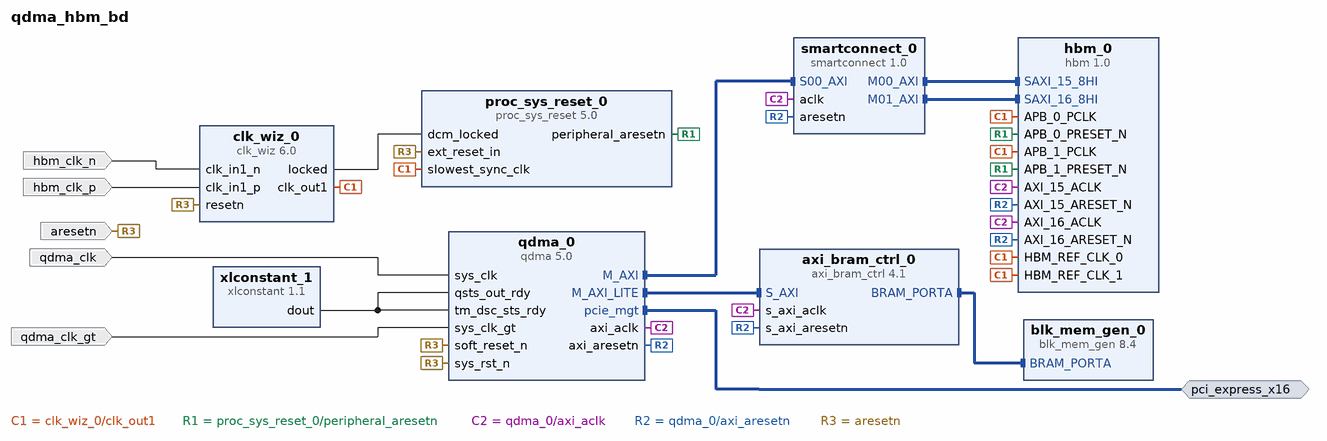
[diagram p0: block diagram of the top level]
# Vivado block design qdma_hbm_bd, xcu55c-fsvh2892-2L-e, Vivado 2024.2
create_bd_design qdma_hbm_bd

create_bd_intf_port -mode Master -vlnv xilinx.com:interface:pcie_7x_mgt_rtl:1.0 pci_express_x16
create_bd_port -dir I -type clk hbm_clk_n
set_property -dict {CONFIG.FREQ_HZ 100000000} [get_bd_ports hbm_clk_n]
create_bd_port -dir I -type clk hbm_clk_p
set_property -dict {CONFIG.FREQ_HZ 100000000} [get_bd_ports hbm_clk_p]
create_bd_port -dir I -type rst aresetn
create_bd_port -dir I -type clk qdma_clk
create_bd_port -dir I -type clk qdma_clk_gt

create_bd_cell -type ip -vlnv xilinx.com:ip:hbm:1.0 hbm_0
set_property -dict [list \
  CONFIG.USER_APB_EN false \
  CONFIG.USER_AXI_INPUT_CLK1_FREQ 250 \
  CONFIG.USER_AXI_INPUT_CLK_FREQ 250 \
  CONFIG.USER_HBM_DENSITY 16GB \
  CONFIG.USER_MC0_USER_PARITY_EN false \
  CONFIG.USER_SAXI_00 false \
  CONFIG.USER_SAXI_01 false \
  CONFIG.USER_SAXI_02 false \
  CONFIG.USER_SAXI_03 false \
  CONFIG.USER_SAXI_04 false \
  CONFIG.USER_SAXI_05 false \
  CONFIG.USER_SAXI_06 false \
  CONFIG.USER_SAXI_07 false \
  CONFIG.USER_SAXI_08 false \
  CONFIG.USER_SAXI_09 false \
  CONFIG.USER_SAXI_10 false \
  CONFIG.USER_SAXI_11 false \
  CONFIG.USER_SAXI_12 false \
  CONFIG.USER_SAXI_13 false \
  CONFIG.USER_SAXI_14 false \
  CONFIG.USER_SAXI_17 false \
  CONFIG.USER_SAXI_18 false \
  CONFIG.USER_SAXI_19 false \
  CONFIG.USER_SAXI_20 false \
  CONFIG.USER_SAXI_21 false \
  CONFIG.USER_SAXI_22 false \
  CONFIG.USER_SAXI_23 false \
  CONFIG.USER_SAXI_24 false \
  CONFIG.USER_SAXI_25 false \
  CONFIG.USER_SAXI_26 false \
  CONFIG.USER_SAXI_27 false \
  CONFIG.USER_SAXI_28 false \
  CONFIG.USER_SAXI_29 false \
  CONFIG.USER_SAXI_30 false \
  CONFIG.USER_SAXI_31 false \
] [get_bd_cells hbm_0]
create_bd_cell -type ip -vlnv xilinx.com:ip:smartconnect:1.0 smartconnect_0
set_property -dict {CONFIG.NUM_MI 2 CONFIG.NUM_SI 1} [get_bd_cells smartconnect_0]
create_bd_cell -type ip -vlnv xilinx.com:ip:clk_wiz:6.0 clk_wiz_0
set_property -dict [list \
  CONFIG.PRIM_SOURCE Differential_clock_capable_pin \
  CONFIG.RESET_PORT resetn \
  CONFIG.RESET_TYPE ACTIVE_LOW \
] [get_bd_cells clk_wiz_0]
create_bd_cell -type ip -vlnv xilinx.com:ip:proc_sys_reset:5.0 proc_sys_reset_0
create_bd_cell -type ip -vlnv xilinx.com:ip:qdma:5.0 qdma_0
set_property -dict [list \
  CONFIG.dma_intf_sel_qdma AXI_MM \
  CONFIG.en_gt_selection false \
  CONFIG.mode_selection Advanced \
  CONFIG.num_queues 2048 \
  CONFIG.pcie_blk_locn PCIE4C_X1Y0 \
  CONFIG.pf0_bar2_enabled_qdma true \
  CONFIG.pf0_msix_enabled_qdma false \
  CONFIG.pl_link_cap_max_link_width X16 \
] [get_bd_cells qdma_0]
create_bd_cell -type ip -vlnv xilinx.com:ip:blk_mem_gen:8.4 blk_mem_gen_0
create_bd_cell -type ip -vlnv xilinx.com:ip:axi_bram_ctrl:4.1 axi_bram_ctrl_0
set_property -dict {CONFIG.PROTOCOL AXI4LITE CONFIG.SINGLE_PORT_BRAM 1} [get_bd_cells axi_bram_ctrl_0]
create_bd_cell -type ip -vlnv xilinx.com:ip:xlconstant:1.1 xlconstant_1

# ---- connections ----

connect_bd_intf_net [get_bd_intf_pins axi_bram_ctrl_0/BRAM_PORTA] [get_bd_intf_pins blk_mem_gen_0/BRAM_PORTA]
connect_bd_intf_net [get_bd_intf_pins qdma_0/M_AXI] [get_bd_intf_pins smartconnect_0/S00_AXI]
connect_bd_intf_net [get_bd_intf_pins qdma_0/M_AXI_LITE] [get_bd_intf_pins axi_bram_ctrl_0/S_AXI]
connect_bd_intf_net [get_bd_intf_ports pci_express_x16] [get_bd_intf_pins qdma_0/pcie_mgt]
connect_bd_intf_net [get_bd_intf_pins smartconnect_0/M00_AXI] [get_bd_intf_pins hbm_0/SAXI_15_8HI]
connect_bd_intf_net [get_bd_intf_pins smartconnect_0/M01_AXI] [get_bd_intf_pins hbm_0/SAXI_16_8HI]
connect_bd_net -net aclk_n_1 [get_bd_ports hbm_clk_n] [get_bd_pins clk_wiz_0/clk_in1_n]
connect_bd_net -net aclk_p_1 [get_bd_ports hbm_clk_p] [get_bd_pins clk_wiz_0/clk_in1_p]
connect_bd_net [get_bd_pins clk_wiz_0/clk_out1] \
  [get_bd_pins hbm_0/HBM_REF_CLK_0] [get_bd_pins hbm_0/HBM_REF_CLK_1] [get_bd_pins hbm_0/APB_0_PCLK] \
  [get_bd_pins hbm_0/APB_1_PCLK] [get_bd_pins proc_sys_reset_0/slowest_sync_clk]
connect_bd_net [get_bd_pins clk_wiz_0/locked] [get_bd_pins proc_sys_reset_0/dcm_locked]
connect_bd_net [get_bd_pins proc_sys_reset_0/peripheral_aresetn] [get_bd_pins hbm_0/APB_0_PRESET_N] [get_bd_pins hbm_0/APB_1_PRESET_N]
connect_bd_net [get_bd_pins qdma_0/axi_aclk] \
  [get_bd_pins smartconnect_0/aclk] [get_bd_pins hbm_0/AXI_15_ACLK] [get_bd_pins hbm_0/AXI_16_ACLK] \
  [get_bd_pins axi_bram_ctrl_0/s_axi_aclk]
connect_bd_net [get_bd_pins qdma_0/axi_aresetn] \
  [get_bd_pins smartconnect_0/aresetn] [get_bd_pins hbm_0/AXI_15_ARESET_N] [get_bd_pins hbm_0/AXI_16_ARESET_N] \
  [get_bd_pins axi_bram_ctrl_0/s_axi_aresetn]
connect_bd_net -net resetn_0_1 [get_bd_ports aresetn] \
  [get_bd_pins proc_sys_reset_0/ext_reset_in] [get_bd_pins clk_wiz_0/resetn] [get_bd_pins qdma_0/sys_rst_n] \
  [get_bd_pins qdma_0/soft_reset_n]
connect_bd_net -net sys_clk_0_1 [get_bd_ports qdma_clk] [get_bd_pins qdma_0/sys_clk]
connect_bd_net -net sys_clk_gt_0_1 [get_bd_ports qdma_clk_gt] [get_bd_pins qdma_0/sys_clk_gt]
connect_bd_net [get_bd_pins xlconstant_1/dout] [get_bd_pins qdma_0/tm_dsc_sts_rdy] [get_bd_pins qdma_0/qsts_out_rdy]

# ---- address map ----
assign_bd_address -offset 0x0000000000000000 -range 512M -target_address_space [get_bd_addr_spaces qdma_0/M_AXI] [get_bd_addr_segs hbm_0/SAXI_15_8HI/HBM_MEM00]
assign_bd_address -offset 0x0000000020000000 -range 512M -target_address_space [get_bd_addr_spaces qdma_0/M_AXI] [get_bd_addr_segs hbm_0/SAXI_15_8HI/HBM_MEM01]
assign_bd_address -offset 0x0000000040000000 -range 512M -target_address_space [get_bd_addr_spaces qdma_0/M_AXI] [get_bd_addr_segs hbm_0/SAXI_15_8HI/HBM_MEM02]
assign_bd_address -offset 0x0000000060000000 -range 512M -target_address_space [get_bd_addr_spaces qdma_0/M_AXI] [get_bd_addr_segs hbm_0/SAXI_15_8HI/HBM_MEM03]
assign_bd_address -offset 0x0000000080000000 -range 512M -target_address_space [get_bd_addr_spaces qdma_0/M_AXI] [get_bd_addr_segs hbm_0/SAXI_15_8HI/HBM_MEM04]
assign_bd_address -offset 0x00000000A0000000 -range 512M -target_address_space [get_bd_addr_spaces qdma_0/M_AXI] [get_bd_addr_segs hbm_0/SAXI_15_8HI/HBM_MEM05]
assign_bd_address -offset 0x00000000C0000000 -range 512M -target_address_space [get_bd_addr_spaces qdma_0/M_AXI] [get_bd_addr_segs hbm_0/SAXI_15_8HI/HBM_MEM06]
assign_bd_address -offset 0x00000000E0000000 -range 512M -target_address_space [get_bd_addr_spaces qdma_0/M_AXI] [get_bd_addr_segs hbm_0/SAXI_15_8HI/HBM_MEM07]
assign_bd_address -offset 0x0000000100000000 -range 512M -target_address_space [get_bd_addr_spaces qdma_0/M_AXI] [get_bd_addr_segs hbm_0/SAXI_15_8HI/HBM_MEM08]
assign_bd_address -offset 0x0000000120000000 -range 512M -target_address_space [get_bd_addr_spaces qdma_0/M_AXI] [get_bd_addr_segs hbm_0/SAXI_15_8HI/HBM_MEM09]
assign_bd_address -offset 0x0000000140000000 -range 512M -target_address_space [get_bd_addr_spaces qdma_0/M_AXI] [get_bd_addr_segs hbm_0/SAXI_15_8HI/HBM_MEM10]
assign_bd_address -offset 0x0000000160000000 -range 512M -target_address_space [get_bd_addr_spaces qdma_0/M_AXI] [get_bd_addr_segs hbm_0/SAXI_15_8HI/HBM_MEM11]
assign_bd_address -offset 0x0000000180000000 -range 512M -target_address_space [get_bd_addr_spaces qdma_0/M_AXI] [get_bd_addr_segs hbm_0/SAXI_15_8HI/HBM_MEM12]
assign_bd_address -offset 0x00000001A0000000 -range 512M -target_address_space [get_bd_addr_spaces qdma_0/M_AXI] [get_bd_addr_segs hbm_0/SAXI_15_8HI/HBM_MEM13]
assign_bd_address -offset 0x00000001C0000000 -range 512M -target_address_space [get_bd_addr_spaces qdma_0/M_AXI] [get_bd_addr_segs hbm_0/SAXI_15_8HI/HBM_MEM14]
assign_bd_address -offset 0x00000001E0000000 -range 512M -target_address_space [get_bd_addr_spaces qdma_0/M_AXI] [get_bd_addr_segs hbm_0/SAXI_15_8HI/HBM_MEM15]
assign_bd_address -offset 0x0000000200000000 -range 512M -target_address_space [get_bd_addr_spaces qdma_0/M_AXI] [get_bd_addr_segs hbm_0/SAXI_16_8HI/HBM_MEM16]
assign_bd_address -offset 0x0000000220000000 -range 512M -target_address_space [get_bd_addr_spaces qdma_0/M_AXI] [get_bd_addr_segs hbm_0/SAXI_16_8HI/HBM_MEM17]
assign_bd_address -offset 0x0000000240000000 -range 512M -target_address_space [get_bd_addr_spaces qdma_0/M_AXI] [get_bd_addr_segs hbm_0/SAXI_16_8HI/HBM_MEM18]
assign_bd_address -offset 0x0000000260000000 -range 512M -target_address_space [get_bd_addr_spaces qdma_0/M_AXI] [get_bd_addr_segs hbm_0/SAXI_16_8HI/HBM_MEM19]
assign_bd_address -offset 0x0000000280000000 -range 512M -target_address_space [get_bd_addr_spaces qdma_0/M_AXI] [get_bd_addr_segs hbm_0/SAXI_16_8HI/HBM_MEM20]
assign_bd_address -offset 0x00000002A0000000 -range 512M -target_address_space [get_bd_addr_spaces qdma_0/M_AXI] [get_bd_addr_segs hbm_0/SAXI_16_8HI/HBM_MEM21]
assign_bd_address -offset 0x00000002C0000000 -range 512M -target_address_space [get_bd_addr_spaces qdma_0/M_AXI] [get_bd_addr_segs hbm_0/SAXI_16_8HI/HBM_MEM22]
assign_bd_address -offset 0x00000002E0000000 -range 512M -target_address_space [get_bd_addr_spaces qdma_0/M_AXI] [get_bd_addr_segs hbm_0/SAXI_16_8HI/HBM_MEM23]
assign_bd_address -offset 0x0000000300000000 -range 512M -target_address_space [get_bd_addr_spaces qdma_0/M_AXI] [get_bd_addr_segs hbm_0/SAXI_16_8HI/HBM_MEM24]
assign_bd_address -offset 0x0000000320000000 -range 512M -target_address_space [get_bd_addr_spaces qdma_0/M_AXI] [get_bd_addr_segs hbm_0/SAXI_16_8HI/HBM_MEM25]
assign_bd_address -offset 0x0000000340000000 -range 512M -target_address_space [get_bd_addr_spaces qdma_0/M_AXI] [get_bd_addr_segs hbm_0/SAXI_16_8HI/HBM_MEM26]
assign_bd_address -offset 0x0000000360000000 -range 512M -target_address_space [get_bd_addr_spaces qdma_0/M_AXI] [get_bd_addr_segs hbm_0/SAXI_16_8HI/HBM_MEM27]
assign_bd_address -offset 0x0000000380000000 -range 512M -target_address_space [get_bd_addr_spaces qdma_0/M_AXI] [get_bd_addr_segs hbm_0/SAXI_16_8HI/HBM_MEM28]
assign_bd_address -offset 0x00000003A0000000 -range 512M -target_address_space [get_bd_addr_spaces qdma_0/M_AXI] [get_bd_addr_segs hbm_0/SAXI_16_8HI/HBM_MEM29]
assign_bd_address -offset 0x00000003C0000000 -range 512M -target_address_space [get_bd_addr_spaces qdma_0/M_AXI] [get_bd_addr_segs hbm_0/SAXI_16_8HI/HBM_MEM30]
assign_bd_address -offset 0x00000003E0000000 -range 512M -target_address_space [get_bd_addr_spaces qdma_0/M_AXI] [get_bd_addr_segs hbm_0/SAXI_16_8HI/HBM_MEM31]
exclude_bd_addr_seg -offset 0x0000000000000000 -range 512M -target_address_space [get_bd_addr_spaces qdma_0/M_AXI] [get_bd_addr_segs hbm_0/SAXI_16_8HI/HBM_MEM00]
exclude_bd_addr_seg -offset 0x0000000420000000 -range 512M -target_address_space [get_bd_addr_spaces qdma_0/M_AXI] [get_bd_addr_segs hbm_0/SAXI_16_8HI/HBM_MEM01]
exclude_bd_addr_seg -offset 0x0000000440000000 -range 512M -target_address_space [get_bd_addr_spaces qdma_0/M_AXI] [get_bd_addr_segs hbm_0/SAXI_16_8HI/HBM_MEM02]
exclude_bd_addr_seg -offset 0x0000000460000000 -range 512M -target_address_space [get_bd_addr_spaces qdma_0/M_AXI] [get_bd_addr_segs hbm_0/SAXI_16_8HI/HBM_MEM03]
exclude_bd_addr_seg -offset 0x0000000480000000 -range 512M -target_address_space [get_bd_addr_spaces qdma_0/M_AXI] [get_bd_addr_segs hbm_0/SAXI_16_8HI/HBM_MEM04]
exclude_bd_addr_seg -offset 0x00000004A0000000 -range 512M -target_address_space [get_bd_addr_spaces qdma_0/M_AXI] [get_bd_addr_segs hbm_0/SAXI_16_8HI/HBM_MEM05]
exclude_bd_addr_seg -offset 0x00000004C0000000 -range 512M -target_address_space [get_bd_addr_spaces qdma_0/M_AXI] [get_bd_addr_segs hbm_0/SAXI_16_8HI/HBM_MEM06]
exclude_bd_addr_seg -offset 0x00000004E0000000 -range 512M -target_address_space [get_bd_addr_spaces qdma_0/M_AXI] [get_bd_addr_segs hbm_0/SAXI_16_8HI/HBM_MEM07]
exclude_bd_addr_seg -offset 0x0000000500000000 -range 512M -target_address_space [get_bd_addr_spaces qdma_0/M_AXI] [get_bd_addr_segs hbm_0/SAXI_16_8HI/HBM_MEM08]
exclude_bd_addr_seg -offset 0x0000000520000000 -range 512M -target_address_space [get_bd_addr_spaces qdma_0/M_AXI] [get_bd_addr_segs hbm_0/SAXI_16_8HI/HBM_MEM09]
exclude_bd_addr_seg -offset 0x0000000540000000 -range 512M -target_address_space [get_bd_addr_spaces qdma_0/M_AXI] [get_bd_addr_segs hbm_0/SAXI_16_8HI/HBM_MEM10]
exclude_bd_addr_seg -offset 0x0000000560000000 -range 512M -target_address_space [get_bd_addr_spaces qdma_0/M_AXI] [get_bd_addr_segs hbm_0/SAXI_16_8HI/HBM_MEM11]
exclude_bd_addr_seg -offset 0x0000000580000000 -range 512M -target_address_space [get_bd_addr_spaces qdma_0/M_AXI] [get_bd_addr_segs hbm_0/SAXI_16_8HI/HBM_MEM12]
exclude_bd_addr_seg -offset 0x00000005A0000000 -range 512M -target_address_space [get_bd_addr_spaces qdma_0/M_AXI] [get_bd_addr_segs hbm_0/SAXI_16_8HI/HBM_MEM13]
exclude_bd_addr_seg -offset 0x00000005C0000000 -range 512M -target_address_space [get_bd_addr_spaces qdma_0/M_AXI] [get_bd_addr_segs hbm_0/SAXI_16_8HI/HBM_MEM14]
exclude_bd_addr_seg -offset 0x00000005E0000000 -range 512M -target_address_space [get_bd_addr_spaces qdma_0/M_AXI] [get_bd_addr_segs hbm_0/SAXI_16_8HI/HBM_MEM15]
exclude_bd_addr_seg -offset 0x0000000600000000 -range 512M -target_address_space [get_bd_addr_spaces qdma_0/M_AXI] [get_bd_addr_segs hbm_0/SAXI_15_8HI/HBM_MEM16]
exclude_bd_addr_seg -offset 0x0000000620000000 -range 512M -target_address_space [get_bd_addr_spaces qdma_0/M_AXI] [get_bd_addr_segs hbm_0/SAXI_15_8HI/HBM_MEM17]
exclude_bd_addr_seg -offset 0x0000000640000000 -range 512M -target_address_space [get_bd_addr_spaces qdma_0/M_AXI] [get_bd_addr_segs hbm_0/SAXI_15_8HI/HBM_MEM18]
exclude_bd_addr_seg -offset 0x0000000660000000 -range 512M -target_address_space [get_bd_addr_spaces qdma_0/M_AXI] [get_bd_addr_segs hbm_0/SAXI_15_8HI/HBM_MEM19]
exclude_bd_addr_seg -offset 0x0000000680000000 -range 512M -target_address_space [get_bd_addr_spaces qdma_0/M_AXI] [get_bd_addr_segs hbm_0/SAXI_15_8HI/HBM_MEM20]
exclude_bd_addr_seg -offset 0x00000006A0000000 -range 512M -target_address_space [get_bd_addr_spaces qdma_0/M_AXI] [get_bd_addr_segs hbm_0/SAXI_15_8HI/HBM_MEM21]
exclude_bd_addr_seg -offset 0x00000006C0000000 -range 512M -target_address_space [get_bd_addr_spaces qdma_0/M_AXI] [get_bd_addr_segs hbm_0/SAXI_15_8HI/HBM_MEM22]
exclude_bd_addr_seg -offset 0x00000006E0000000 -range 512M -target_address_space [get_bd_addr_spaces qdma_0/M_AXI] [get_bd_addr_segs hbm_0/SAXI_15_8HI/HBM_MEM23]
exclude_bd_addr_seg -offset 0x0000000700000000 -range 512M -target_address_space [get_bd_addr_spaces qdma_0/M_AXI] [get_bd_addr_segs hbm_0/SAXI_15_8HI/HBM_MEM24]
exclude_bd_addr_seg -offset 0x0000000720000000 -range 512M -target_address_space [get_bd_addr_spaces qdma_0/M_AXI] [get_bd_addr_segs hbm_0/SAXI_15_8HI/HBM_MEM25]
exclude_bd_addr_seg -offset 0x0000000740000000 -range 512M -target_address_space [get_bd_addr_spaces qdma_0/M_AXI] [get_bd_addr_segs hbm_0/SAXI_15_8HI/HBM_MEM26]
exclude_bd_addr_seg -offset 0x0000000760000000 -range 512M -target_address_space [get_bd_addr_spaces qdma_0/M_AXI] [get_bd_addr_segs hbm_0/SAXI_15_8HI/HBM_MEM27]
exclude_bd_addr_seg -offset 0x0000000780000000 -range 512M -target_address_space [get_bd_addr_spaces qdma_0/M_AXI] [get_bd_addr_segs hbm_0/SAXI_15_8HI/HBM_MEM28]
exclude_bd_addr_seg -offset 0x00000007A0000000 -range 512M -target_address_space [get_bd_addr_spaces qdma_0/M_AXI] [get_bd_addr_segs hbm_0/SAXI_15_8HI/HBM_MEM29]
exclude_bd_addr_seg -offset 0x00000007C0000000 -range 512M -target_address_space [get_bd_addr_spaces qdma_0/M_AXI] [get_bd_addr_segs hbm_0/SAXI_15_8HI/HBM_MEM30]
exclude_bd_addr_seg -offset 0x00000007E0000000 -range 512M -target_address_space [get_bd_addr_spaces qdma_0/M_AXI] [get_bd_addr_segs hbm_0/SAXI_15_8HI/HBM_MEM31]
assign_bd_address -offset 0xC0000000 -range 8K -target_address_space [get_bd_addr_spaces qdma_0/M_AXI_LITE] [get_bd_addr_segs axi_bram_ctrl_0/S_AXI/Mem0]

validate_bd_design
save_bd_design
